# EAGLE schematic ESP32 TempBoard v12 (EAGLE 9.7.0)
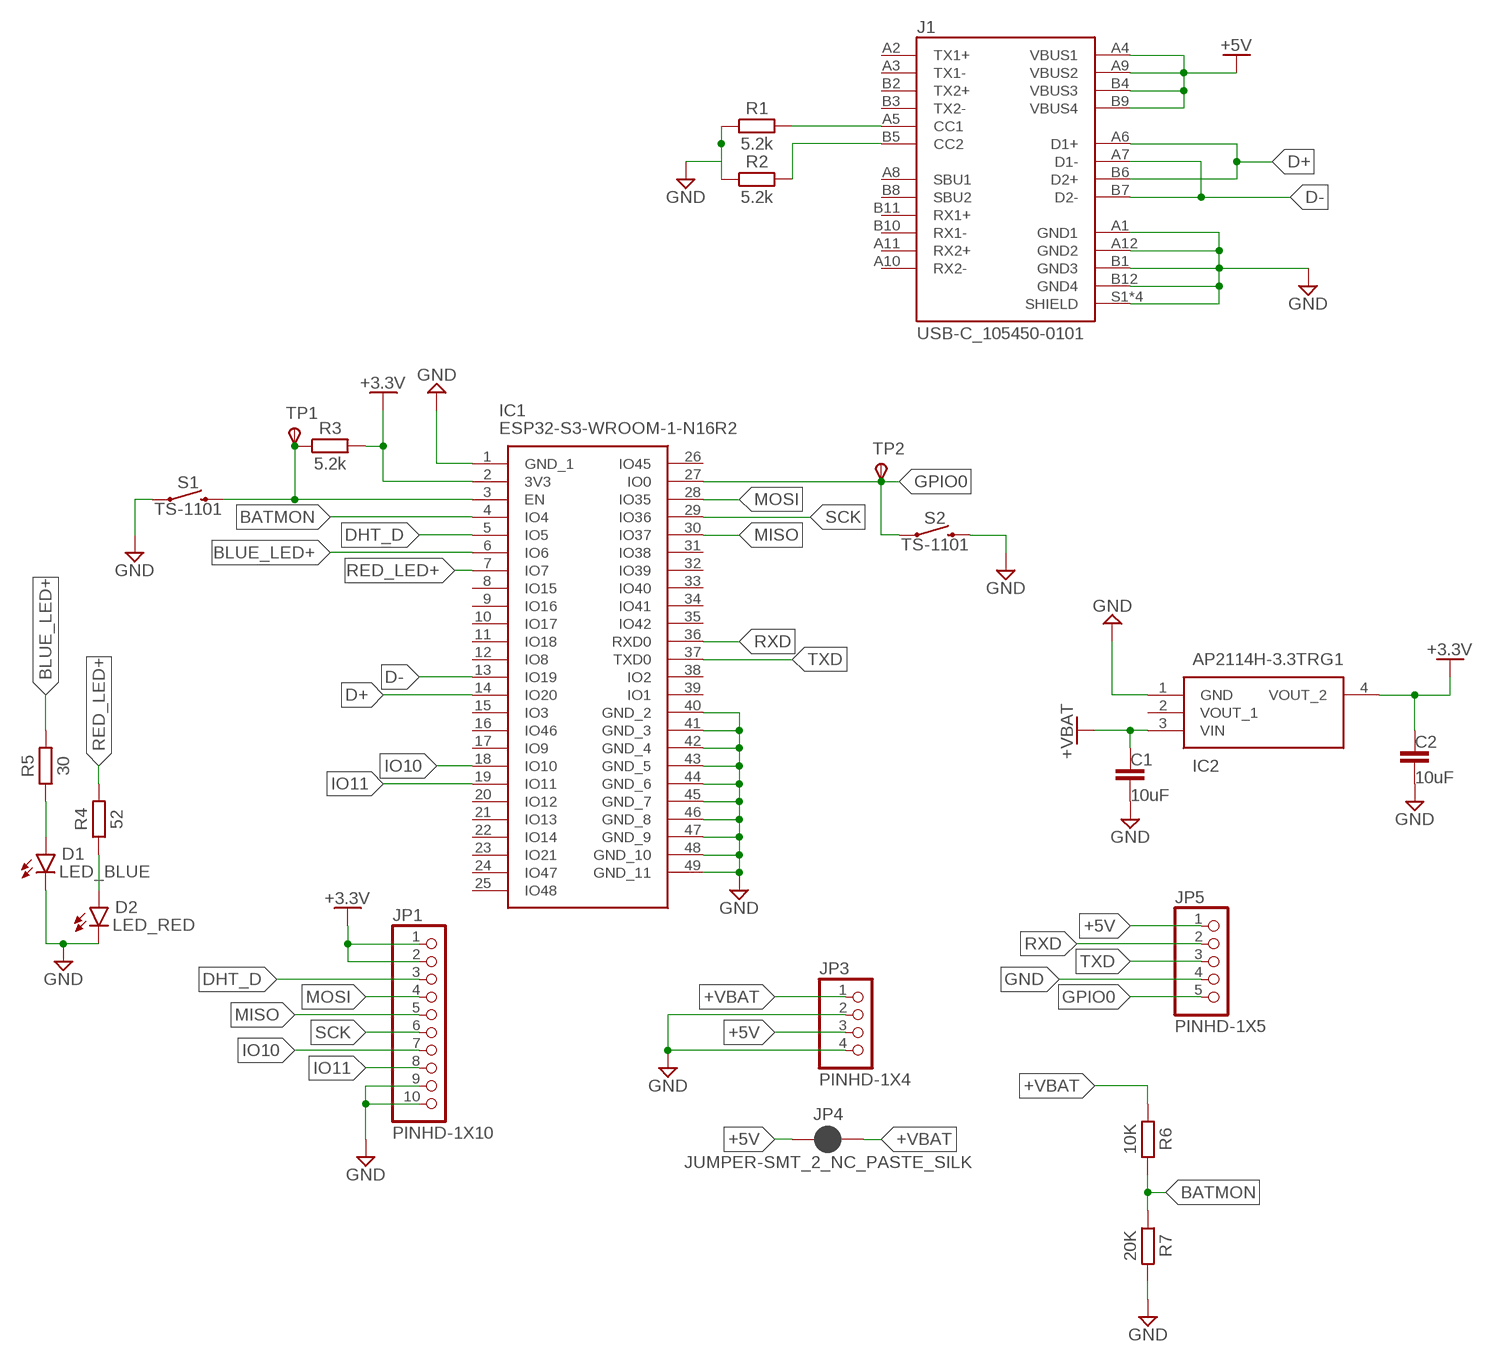
[diagram p0: schematic, sheet 1]

## Parts
C1  10uF  C_CHIP-0805(2012-METRIC)  [CAPC2012X110]
C2  10uF  C_CHIP-0805(2012-METRIC)  [CAPC2012X110]
D1  LED_BLUE  LED_CHIP_BLUE-2012  [LEDC2012X110N_B]
D2  LED_RED  LED_CHIPRED-2012  [LEDC2012X110N_R]
IC1  ESP32-S3-WROOM-1-N16R2  [ESP32S3WROOM1N16R2]
IC2  AP2114H-3.3TRG1  [SOT230P700X180-4N]
J1  USB-C_105450-0101  [MOLEX_105450-0101]
JP1  PINHD-1X10  [1X10]
JP3  PINHD-1X4  [1X04]
JP4  JUMPER-SMT_2_NC_PASTE_SILK  [SMT-JUMPER_2_NC_PASTE_SILK]
JP5  PINHD-1X5  [1X05]
R1  5.2k  R_CHIP-0805(2012-METRIC)  [RESC2012X65]
R2  5.2k  R_CHIP-0805(2012-METRIC)  [RESC2012X65]
R3  5.2k  R_CHIP-0805(2012-METRIC)  [RESC2012X65]
R4  52  R_CHIP-0805(2012-METRIC)  [RESC2012X65]
R5  30  R_CHIP-0805(2012-METRIC)  [RESC2012X65]
R6  10K  R_CHIP-0805(2012-METRIC)  [RESC2012X65]
R7  20K  R_CHIP-0805(2012-METRIC)  [RESC2012X65]
S1  TS-1101  MOMENTARY-SWITCH-SPST-SMD-6.0X3.5MM  [TACTILE_SWITCH_SMD_6.0X3.5MM]
S2  TS-1101  MOMENTARY-SWITCH-SPST-SMD-6.0X3.5MM  [TACTILE_SWITCH_SMD_6.0X3.5MM]
TP1  TPSTP14R  [TP14R]
TP2  TPSTP14R  [TP14R]

## Nets
+3.3V: C2.1 IC1.2(3V3) IC2.4(VOUT_2) JP1.1 JP1.2 R3.2
+5V: J1.A4(VBUS1) J1.A9(VBUS2) J1.B4(VBUS3) J1.B9(VBUS4) JP3.3 JP4.1 JP5.1
+VBAT: C1.1 IC2.3(VIN) JP3.1 JP4.2 R6.1
BATMON: IC1.4(IO4) R6.2 R7.1
BLUE_LED+: IC1.6(IO6) R5.2
D+: IC1.14(IO20) J1.A6(D1+) J1.B6(D2+)
D-: IC1.13(IO19) J1.A7(D1-) J1.B7(D2-)
DHT_D: IC1.5(IO5) JP1.3
GND: C1.2 C2.2 D1.1(C) D2.1(C) IC1.1(GND_1) IC1.40(GND_2) IC1.41(GND_3) IC1.42(GND_4) IC1.43(GND_5) IC1.44(GND_6) IC1.45(GND_7) IC1.46(GND_8) IC1.47(GND_9) IC1.48(GND_10) IC1.49(GND_11) IC2.1(GND) J1.A1(GND1) J1.A12(GND2) J1.B1(GND3) J1.B12(GND4) J1.S1(SHIELD) J1.S2(SHIELD) J1.S3(SHIELD) J1.S4(SHIELD) JP1.9 JP1.10 JP3.2 JP3.4 JP5.4 R1.1 R2.1 R7.2 S1.1 S2.2
GPIO0: IC1.27(IO0) JP5.5 S2.1 TP2.TP(PP)
IO10: IC1.18(IO10) JP1.7
IO11: IC1.19(IO11) JP1.8
MISO: IC1.30(IO37) JP1.5
MOSI: IC1.28(IO35) JP1.4
N$1: J1.A5(CC1) R1.2
N$2: J1.B5(CC2) R2.2
N$3: IC1.3(EN) R3.1 S1.2 TP1.TP(PP)
N$4: D2.2(A) R4.1
N$5: D1.2(A) R5.1
RED_LED+: IC1.7(IO7) R4.2
RXD: IC1.36(RXD0) JP5.2
SCK: IC1.29(IO36) JP1.6
TXD: IC1.37(TXD0) JP5.3
Unconnected: IC1.8(IO15) IC1.9(IO16) IC1.10(IO17) IC1.11(IO18) IC1.12(IO8) IC1.15(IO3) IC1.16(IO46) IC1.17(IO9) IC1.20(IO12) IC1.21(IO13) IC1.22(IO14) IC1.23(IO21) IC1.24(IO47) IC1.25(IO48) IC1.26(IO45) IC1.31(IO38) IC1.32(IO39) IC1.33(IO40) IC1.34(IO41) IC1.35(IO42) IC1.38(IO2) IC1.39(IO1) IC2.2(VOUT_1) J1.A2(TX1+) J1.A3(TX1-) J1.A8(SBU1) J1.A10(RX2-) J1.A11(RX2+) J1.B2(TX2+) J1.B3(TX2-) J1.B8(SBU2) J1.B10(RX1-) J1.B11(RX1+)

## Library data of the parts
C1 C2 = Capacitor:C: Capacitor - Generic; CATEGORY: Capacitor
D1 = Opto-Electronic:LED_CHIP: LED - Generic; CATEGORY: Opto-Electronic; COLOR: Blue; SUB-CATEGORY: LED
D2 = Opto-Electronic:LED_CHIP: LED - Generic; CATEGORY: Opto-Electronic; COLOR: Red; SUB-CATEGORY: LED
IC1 = SamacSys_Parts:ESP32-S3-WROOM-1-N16R2: SMD MODULE, ESP32-S3R2 WITH 2 MB Source: Datasheet <https://www.elpro.org/gb/index.php?controller=attachment&id_attachment=18372>; DESCRIPTION: SMD MODULE, ESP32-S3R2 WITH 2 MB; HEIGHT: 3.25mm; MANUFACTURER_NAME: Espressif Systems; MANUFACTURER_PART_NUMBER: ESP32-S3-WROOM-1-N16R2; MOUSER_PART_NUMBER: 356-ESP32S3WRM1N16R2; MOUSER_PRICE-STOCK: https://www.mouser.co.uk/ProductDetail/Espressif-Systems/ESP32-S3-WROOM-1-N16R2?qs=Li%252BoUPsLEnvy1bxV65eH%2Fw%3D%3D
IC2 = SamacSys_Parts:AP2114H-3.3TRG1: 1A 3.3V Low Noise LDO Regulator SOT223 DiodesZetex AP2114H-3.3TRG1, LDO Voltage Regulator, 1 (Min)A, 3.3 V +/-1.5%, 2.5 6 Vin, 3-Pin SOT-223 Source: Datasheet; DESCRIPTION: 1A 3.3V Low Noise LDO Regulator SOT223 DiodesZetex AP2114H-3.3TRG1, LDO Voltage Regulator, 1 (Min)A, 3.3 V +/-1.5%, 2.5 6 Vin, 3-Pin SOT-223; HEIGHT: 1.8mm; MANUFACTURER_NAME: Diodes Inc.; MANUFACTURER_PART_NUMBER: AP2114H-3.3TRG1; MOUSER_PART_NUMBER: 621-AP2114H-3.3TRG1; MOUSER_PRICE-STOCK: https://www.mouser.co.uk/ProductDetail/Diodes-Incorporated/AP2114H-3.3TRG1?qs=x6A8l6qLYDDSG%2FfwzcsOhw%3D%3D
J1 = Usb-Connectors:USB-C_105450-0101: USB Shielded I/O Receptacle; Type C; Right Angle; Surface Mount; Gold over Nickel Check availability <https://pricing.snapeda.com/parts/105450-0101/Molex/view-part?ref=eda>; AVAILABILITY: In Stock; CHECK_PRICES: https://www.snapeda.com/parts/105450-0101/Molex/view-part/?ref=eda; DESCRIPTION: USB Shielded I/O Receptacle,Type C,Right Angle,Surface Mount,Gold over Nickel | Molex Incorporated 105450-0101; MF: Molex; MP: 105450-0101; PACKAGE: None; PRICE: None; PURCHASE-URL: https://www.snapeda.com/api/url_track_click_mouser/?unipart_id=547391&manufacturer=Molex&part_name=105450-0101&search_term=None; SNAPEDA_LINK: https://www.snapeda.com/parts/105450-0101/Molex/view-part/?ref=snap
JP1 = Connector:PINHD-1X10: PIN HEADER; CATEGORY: Headers; DESCRIPTION: Header, Straight, 10 Position; MANUFACTURER: Generic; MPN: Generic; OPERATING_TEMPERATURE: Generic; PART_STATUS: Active; PITCH: 0.100" (2.54mm); ROHS_COMPLIANCE: Generic; SERIES: Generic; SUB-CATEGORY: Headers, Male Pins; TYPE: Board to Board or Cable, Unshrouded, Through Hole, Straight
JP3 = Connector:PINHD-1X4: PIN HEADER; CATEGORY: Headers; DESCRIPTION: Header, Straight, 4 Position; MANUFACTURER: Generic; MPN: Generic; OPERATING_TEMPERATURE: Generic; PART_STATUS: Active; PITCH: 0.100" (2.54mm); ROHS_COMPLIANCE: Generic; SERIES: Generic; SUB-CATEGORY: Headers, Male Pins; TYPE: Board to Board or Cable, Unshrouded, Through Hole, Straight
JP4 = SparkFun-Jumpers:JUMPER-SMT_2_NC_PASTE: Normally closed solder jumper This jumper has an aperture in the stencil to allow solder paste to bridge the split in the wire so it's normally closed (NC). Wick off the solder to open the connection. Reapply solder to reclose the connection.
JP5 = Connector:PINHD-1X5: PIN HEADER; CATEGORY: Headers; DESCRIPTION: Header, Straight, 5 Position; MANUFACTURER: Generic; MPN: Generic; OPERATING_TEMPERATURE: Generic; PART_STATUS: Active; PITCH: 0.100" (2.54mm); ROHS_COMPLIANCE: Generic; SERIES: Generic; SUB-CATEGORY: Headers, Male Pins; TYPE: Board to Board or Cable, Unshrouded, Through Hole, Straight
R1-R7 = Resistor:R: Resistor Fixed - Generic; CATEGORY: Resistor; SUB-CATEGORY: Fixed
S1 S2 = SparkFun-Switches:MOMENTARY-SWITCH-SPST: Momentary Switch (Pushbutton) - SPST Normally-open (NO) SPST momentary switches (buttons, pushbuttons). Variants PTH-12MM - 12mm square, through-hole Momentary Pushbutton Switch - 12mm Square <https://www.sparkfun.com/products/9190> (COM-09190) PTH-6.0MM, PTH-6.0MM-KIT - 6.0mm square, through-hole Mini Pushbutton Switch <https://www.sparkfun.com/products/97> (COM-00097) KIT package intended for soldering kit's - only one side of pads' copper is exposed. PTH-RIGHT-ANGLE-KIT - Right-angle, through-hole Right Angle Tactile Button <https://www.sparkfun.com/products/10791> - Used on SparkFun BigTime Watch Kit <https://www.sparkfun.com/products/11734> SMD-12MM - 12mm square, surface-mount Tactile Button - SMD (12mm) <https://www.sparkfun.com/products/12993> (COM-12993) Used on SparkFun PicoBoard <https://www.sparkfun.com/products/11888> SMD-4.5MM - 4.5mm Square Trackball Switch Used on SparkFun Blackberry Trackballer Breakout <https://www.sparkfun.com/products/13169> SMD-4.6MMX2.8MM - 4.60mm x 2.80mm, surface mount Used on SparkFun Pro Micro - RP2040 <https://www.sparkfun.com/products/17717> SMD-5.2MM, SMD-5.2-REDUNDANT - 5.2mm square, surface-mount Mini Pushbutton Switch - SMD <https://www.sparkfun.com/products/8720> (COM-08720) Used on Arduino Pro Mini <https://www.sparkfun.com/products/11114> REDUNDANT package connects both switch circuits together SMD-6.0X3.5MM - 6.0 x 3.5mm, surface mount Momentary Reset Switch SMD <https://www.sparkfun.com/products/8229> (COM-08229) SMD-6.2MM-TALL - 6.2mm square, surface mount Tactile Button - SMD (6mm) <https://www.sparkfun.com/products/12992> Used on SparkFun Digital Sandbox <https://www.sparkfun.com/products/12651> SMD-RIGHT-ANGLE - Right-angle, surface mount Used on SparkFun Block for Intel® Edison - Arduino <https://www.sparkfun.com/products/13036>; PROD_ID: SWCH-14278; SF_SKU: COM-08229
TP1 TP2 = testpad:TPS: TEST PIN